# EasyEDA Pro project 刀仓照明灯.eprj

# Schematic 原理图
Board Name: ESP32s3; Create Date: 2025-05-14; Page Name: 电源; Project Name: 刀仓照明灯; Schematic Name: 原理图; Update Date: 2026-03-27; Company: 嘉立创EDA; Page Size: A3; Version: V1.0
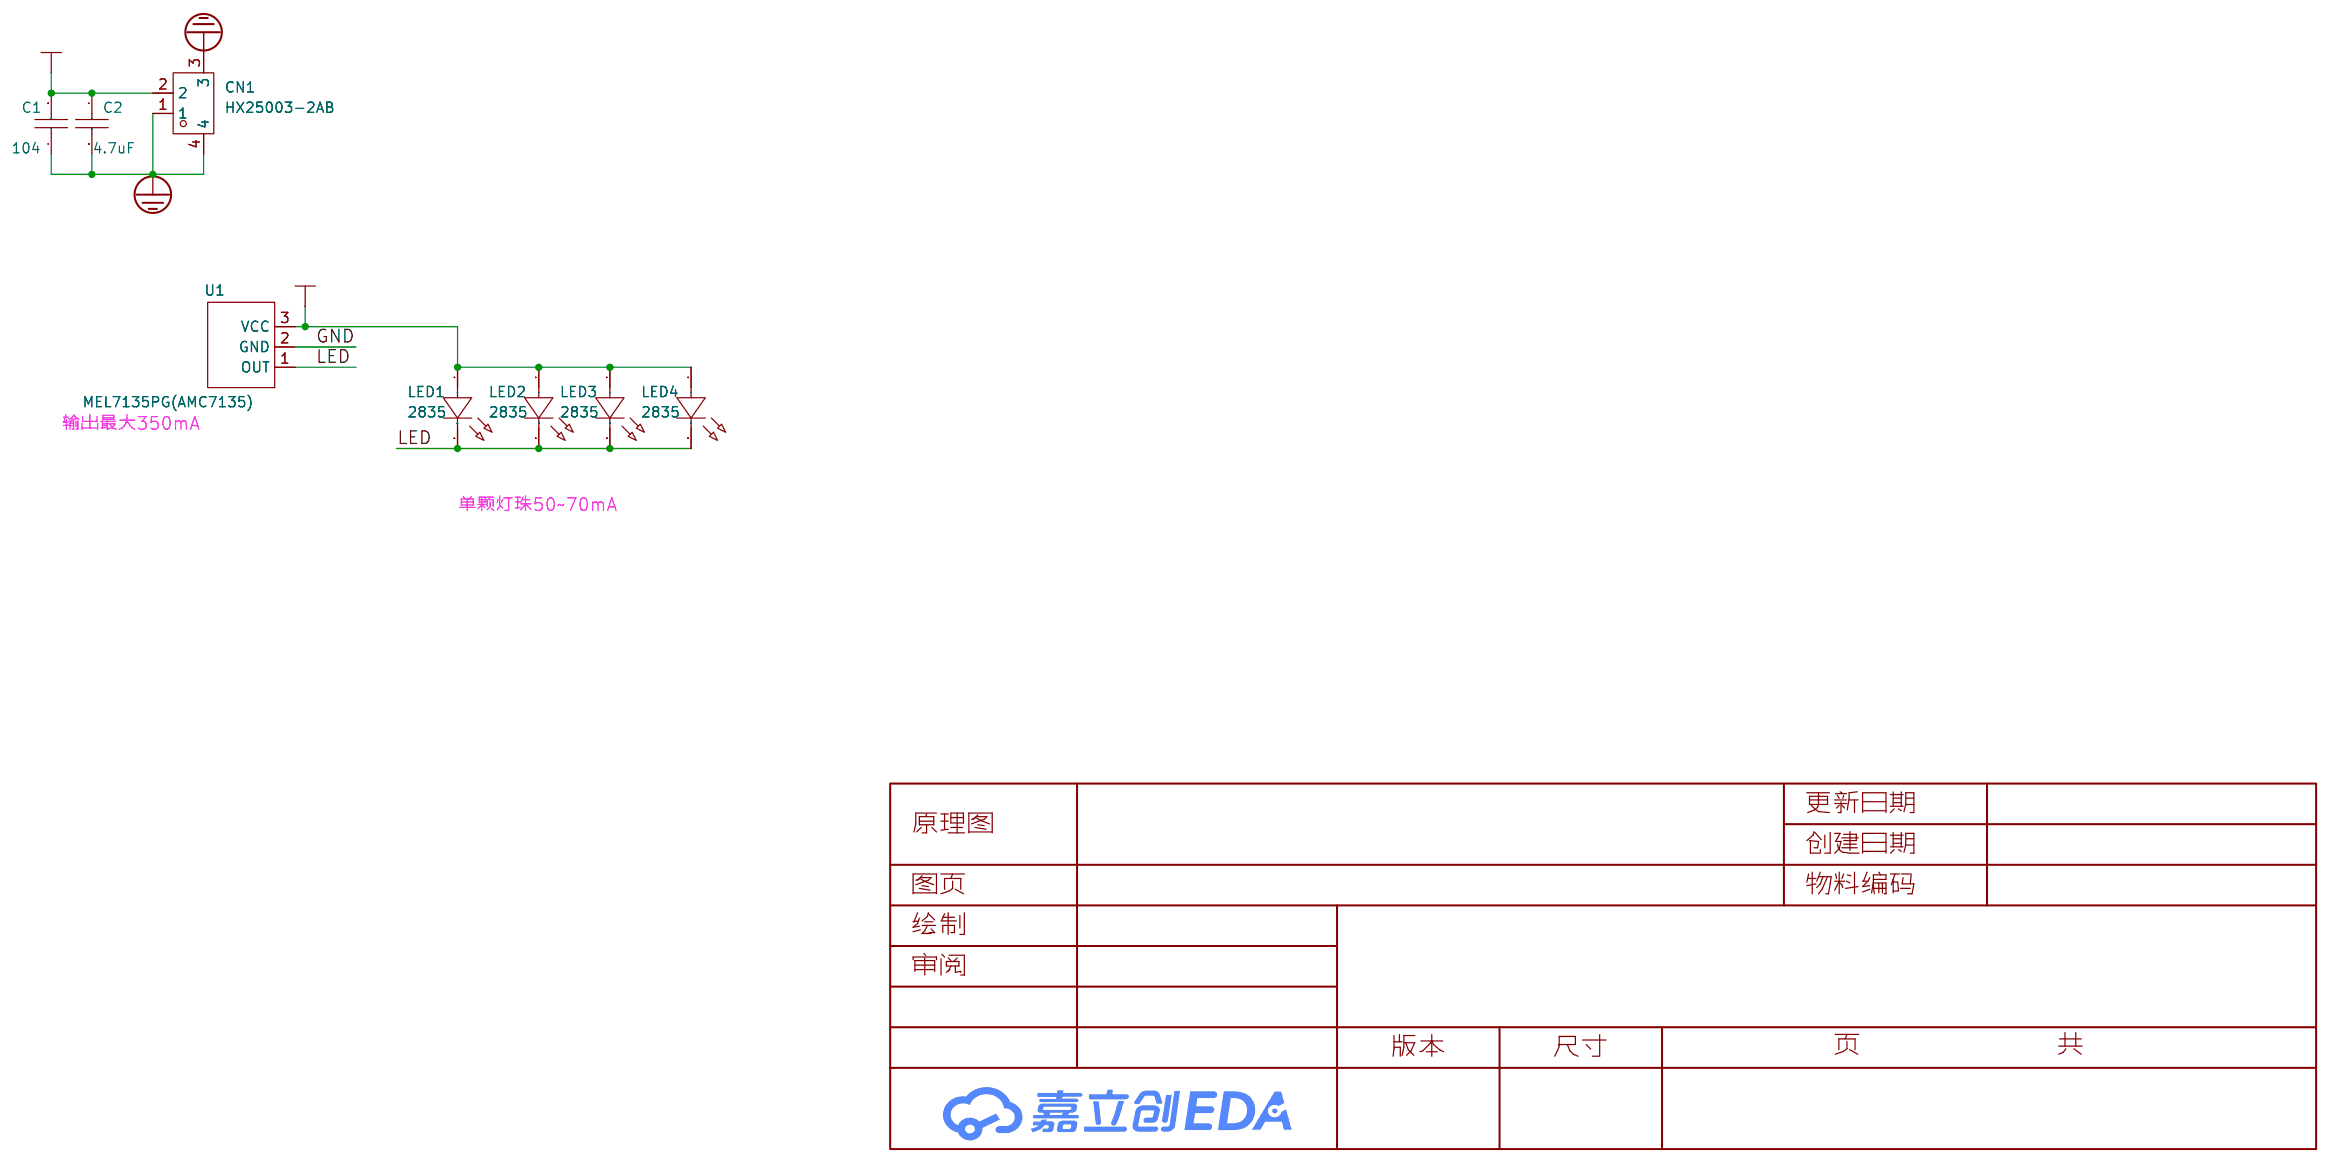
[diagram p0: schematic sheet]

## Parts
C1  104  [0603C]
C2  4.7uF  [0805C]
CN1  HX25003-2AB  [CONN-SMD_P2.50_HX25003-2AB]
LED1  2835  [LED-SMD_L3.5-W2.8_2835]
LED2  2835  [LED-SMD_L3.5-W2.8_2835]
LED3  2835  [LED-SMD_L3.5-W2.8_2835]
LED4  2835  [LED-SMD_L3.5-W2.8_2835]
U1  MEL7135PG(AMC7135)  [SOT-89-3_L4.5-W2.5-P1.50-LS4.2-BR]

## Library data of the parts
C1 = 104: Capacitor (Semiconductor SIM Model); Published: 8-Jun-2000; LatestRevisionDate: 17-Jul-2002; LatestRevisionNote: Re-released for DXP Platform.; PackageReference: C1206; Publisher: Altium Limited; Origin Footprint 2: C1206; Origin Footprint 3: 0402; Origin Footprint 4: 1310[0504]; Origin Footprint 5: 1608[0603]; Origin Footprint 6: C1210; Origin Footprint 7: C0805; Origin Footprint 8: C1206; Origin Footprint 9: 0805; Origin Footprint 10: 0805L; Design Item ID: Cap Semi; Library Name: Miscellaneous Devices
C2 = 105: Design Item ID: CAP; Library Name: SCH--װ--
CN1 = HX25003-2AB: LCSC Part Name: 1x2P 间距:2.5mm 立贴 系列:XH; Supplier Part: C442354; Manufacturer: HX(红星); Supplier Footprint: SMD,P=2.5mm; JLCPCB Part Class: 扩展库; Datasheet: https://item.szlcsc.com/datasheet/HX25003-2AB/442586.html; Supplier: LCSC; Pins Structure: 1x2P; Pitch: 2.5mm; Mounting Type: 立贴; Reference Series: XH; Number of Pins: 2P; Number of Rows: 1; Number of PINs Per Row: 2; Current Rating: 3A; Contact Material: 黄铜; Contact Plating: 锡; Operating Temperature: -25℃~+85℃; Voltage Rating: 250V; Plastic Material: PA66; Flame Retardant Rating: UL94V-0; Color: 白色
LED1-LED4 = 2835: Supplier Part: C9900165166; Supplier Footprint: SMD; Supplier: LCSC
U1 = MEL7135PG: LCSC Part Name: 电流调节器; Supplier Part: C80214; Manufacturer: MICRONE(南京微盟); Supplier Footprint: SOT-89; JLCPCB Part Class: 扩展库; Datasheet: https://item.szlcsc.com/datasheet/MEL7135PG/81359.html; Supplier: LCSC; Voltage - Input(DC): 2.7V~6V; Number of Channels: 1; Output Current: 350mA; Operating temperature: -40℃~+85℃

## Nets
5V_VCC: C1.2 C2.1 CN1.2 LED1.1(A) LED2.1(A) LED3.1(A) LED4.1(A) U1.3(VCC)
GND: C1.1 C2.2 CN1.1 CN1.3 CN1.4 U1.2(GND)
LED: LED1.2(C) LED2.2(C) LED3.2(C) LED4.2(C) U1.1(OUT)

## Notes on the sheet
- 输出最大350mA
- 单颗灯珠50~70mA

# Board PCB
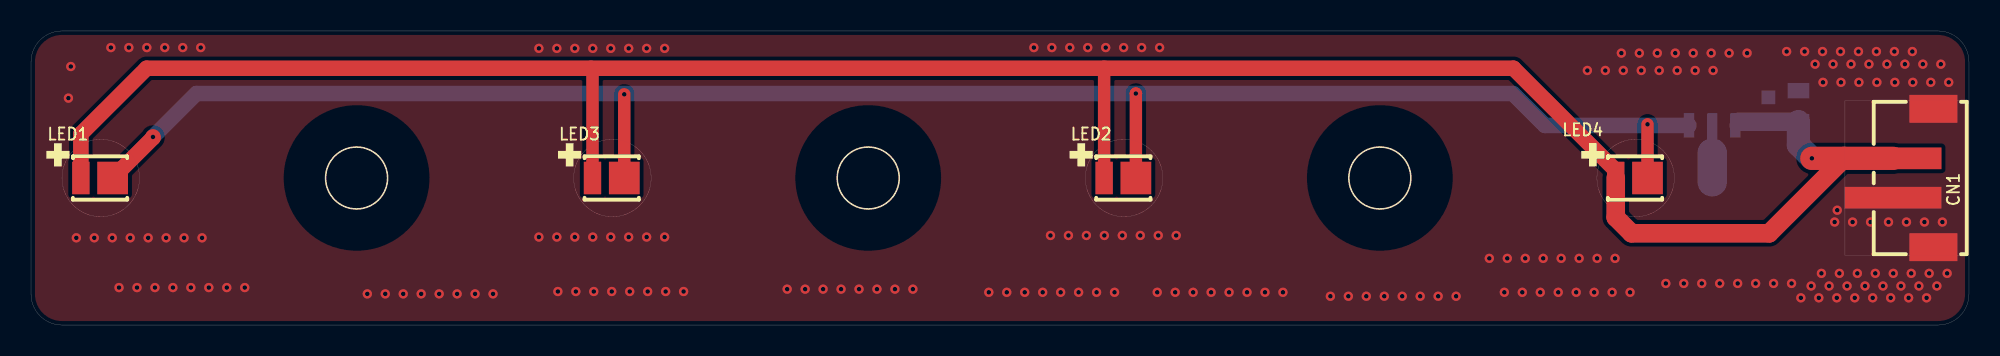
[diagram p1: board, top side]
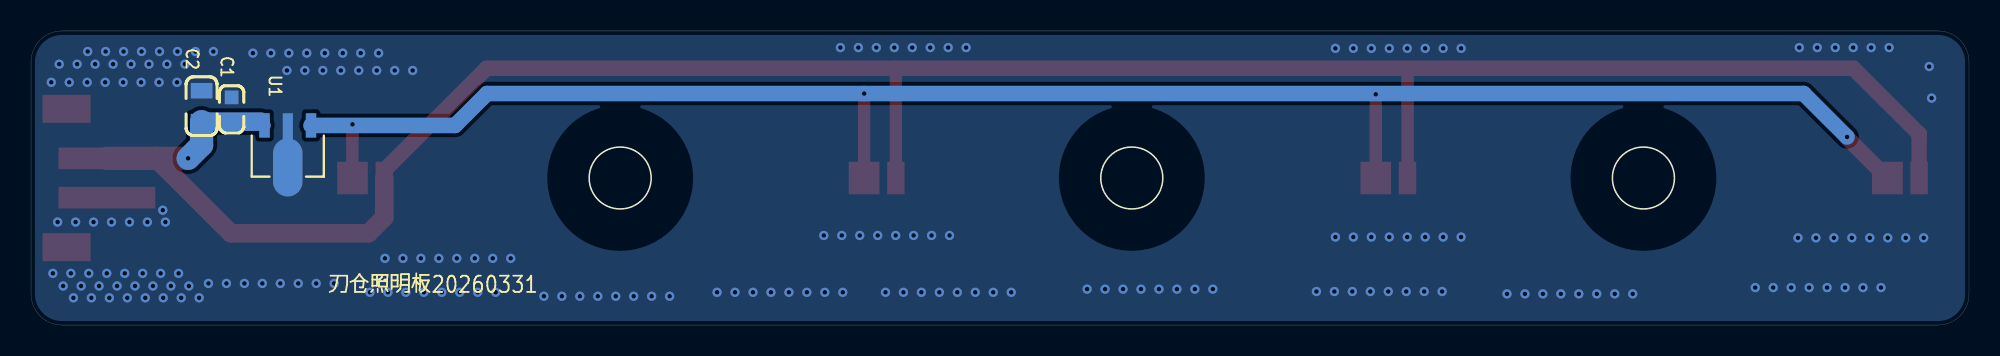
[diagram p2: board, bottom side, seen from below]

Outline 125 x 19 mm; copper layers: Top Layer, Bottom Layer. Coordinates in mm from the lower left corner of the outline.
Outline path: circle c21,9.5 r2 ; circle c54,9.5 r2 ; circle c87,9.5 r2 ; 0,17 arc(0.59,18.41) 2,19 123,19 arc(124.41,18.41) 125,17 125,2 arc(124.41,0.59) 123,0 2,0 arc(0.59,0.59) 0,2 0,17
Stack: Top Layer 0.035mm / Dielectric1 1.51mm FR4 er 4.5 / Bottom Layer 0.035mm

## Design rules (mm)
template: 用户自定义配置
spacing Default (default): track to track 0.152, other pairs 0 to 0.152
track width Default (default): min 0.254, default 0.254, max 25.4
differential pair differentialPair (default): width min 0.127, default 0.254, max 2.54; gap min 0.152, default 0.152
via Default (default): diameter min 0.25, default 0.61, max 100.025; hole min 0.2, default 0.305, max 59.995

## Placement (name value [footprint] x y rotation side)
C1  104  [0603C]  112.06 13.94 270 bottom
C2  4.7uF  [0805C]  114 14.14 90 bottom
CN1  HX25003-2AB  [CONN-SMD_P2.50_HX25003-2AB]  121.03 9.5 90 top
LED1  2835  [LED-SMD_L3.5-W2.8_2835]  4.24 9.5 0 top
LED2  2835  [LED-SMD_L3.5-W2.8_2835]  70.24 9.5 0 top
LED3  2835  [LED-SMD_L3.5-W2.8_2835]  37.24 9.5 0 top
LED4  2835  [LED-SMD_L3.5-W2.8_2835]  103.24 9.5 0 top
U1  MEL7135PG(AMC7135)  [SOT-89-3_L4.5-W2.5-P1.50-LS4.2-BR]  108.44 11.54 90 bottom

## Footprints (pads in the part's own frame, mm; a bottom-side part is the same pattern mirrored in y, then rotated)
0603C
  rect 0.889x0.889 smd: 1(-0.774,0) 2(0.774,0)
0805C
  rect 1x1.4 smd: 1(-1,0) 2(1,0)
CONN-SMD_P2.50_HX25003-2AB
  rect 1.4x6.24 smd: 1(-1.27,0.925) 2(1.27,0.925)
  rect 1.8x3.1 smd: 3(4.47,-1.675) 4(-4.47,-1.675)
LED-SMD_L3.5-W2.8_2835
  rect 1.12x2.1 smd: 1(-1.025,0)
  rect 1.98x2.1 smd: 2(1.025,0)
SOT-89-3_L4.5-W2.5-P1.50-LS4.2-BR
  rect 1.575x0.672 smd: 1(1.356,-1.5) 3(1.356,1.5)
  custom 5.377x1.9 smd: 2(-1.356,0)

## Nets
As in the schematic.

## Via types
v1: diameter 0.6, hole 0.3, Top Layer to Bottom Layer, 205 vias

## Routing (per net, layer and track width the routed paths; a pad name or vN(x,y) marks a point on that pad's centre or on a via; arc(x,y) is an arc through that point)
5V_VCC: length 152.9
  Top Layer w0.8: 36.13,16.59 36.21,16.5 LED3.1 ; 69.23,16.59 69.21,16.58 LED2.1
  Top Layer w1: LED4.1 102.21,9.99 95.62,16.59 7.46,16.59 3.21,12.35 LED1.1
  Top Layer w1.2: LED4.1 102.21,6.95 103.24,5.93 112.11,5.93 116.95,10.77
  Top Layer w1.5: v1(114.87,10.77) CN1.2
  Bottom Layer w0.8: 110.18,13.14 U1.3
  Bottom Layer w1.2: C2.1 110.18,13.14
  Bottom Layer w1.5: v1(114.87,10.77) 114,11.64 C2.1
GND:
  vias: v1(2.41,14.66) v1(2.57,16.7) v1(2.92,5.63) v1(4.08,5.63) v1(5.15,17.93) v1(5.24,5.63) v1(5.68,2.42) v1(6.31,17.93) v1(6.4,5.63) v1(6.84,2.42) v1(7.47,17.93) v1(7.56,5.63) v1(7.99,2.42) v1(8.63,17.93) v1(8.71,5.63) v1(9.15,2.42) v1(9.79,17.93) v1(9.87,5.63) v1(10.31,2.42) v1(10.94,17.93) v1(11.03,5.63) v1(11.47,2.42) v1(12.63,2.42) v1(13.79,2.42) v1(21.69,2.01) v1(22.85,2.01) v1(24.01,2.01) v1(25.17,2.01) v1(26.33,2.01) v1(27.48,2.01) v1(28.64,2.01) v1(29.8,2.01) v1(32.76,17.88) v1(32.76,5.69) v1(33.92,17.88) v1(33.92,5.69) v1(33.98,2.17) v1(35.08,17.88) v1(35.08,5.69) v1(35.14,2.17) v1(36.23,17.88) v1(36.23,5.69) v1(36.3,2.17) v1(37.39,17.88) v1(37.39,5.69) v1(37.46,2.17) v1(38.55,17.88) v1(38.55,5.69) v1(38.62,2.17) v1(39.71,17.88) v1(39.71,5.69) v1(39.77,2.17) v1(40.87,17.88) v1(40.87,5.69) v1(40.93,2.17) v1(42.09,2.17) v1(48.77,2.32) v1(49.93,2.32) v1(51.09,2.32) v1(52.25,2.32) v1(53.41,2.32) v1(54.56,2.32) v1(55.72,2.32) v1(56.88,2.32) v1(61.78,2.12) v1(62.94,2.12) v1(64.09,2.12) v1(64.68,17.93) v1(65.25,2.12) v1(65.76,5.79) v1(65.84,17.93) v1(66.41,2.12) v1(66.91,5.79) v1(67,17.93) v1(67.57,2.12) v1(68.07,5.79) v1(68.16,17.93) v1(68.73,2.12) v1(69.23,5.79) v1(69.32,17.93) v1(69.89,2.12) v1(70.39,5.79) v1(70.48,17.93) v1(71.55,5.79) v1(71.64,17.93) v1(72.71,5.79) v1(72.64,2.12) v1(72.79,17.93) v1(73.8,2.12) v1(73.86,5.79) v1(74.96,2.12) v1(76.12,2.12) v1(77.27,2.12) v1(78.43,2.12) v1(79.59,2.12) v1(80.75,2.12) v1(83.81,1.86) v1(84.97,1.86) v1(86.13,1.86) v1(87.29,1.86) v1(88.44,1.86) v1(89.6,1.86) v1(90.76,1.86) v1(91.92,1.86) v1(94.06,4.31) v1(95.03,2.12) v1(95.22,4.31) v1(96.19,2.12) v1(96.38,4.31) v1(97.35,2.12) v1(97.54,4.31) v1(98.51,2.12) v1(98.7,4.31) v1(99.66,2.12) v1(99.85,4.31) v1(100.39,16.45) v1(100.82,2.12) v1(101.01,4.31) v1(101.54,16.45) v1(101.98,2.12) v1(102.17,4.31) v1(102.58,17.57) v1(102.7,16.45) v1(103.14,2.12) v1(103.74,17.57) v1(103.86,16.45) v1(104.89,17.57) v1(105.02,16.45) v1(105.45,2.69) v1(106.05,17.57) v1(106.18,16.45) v1(106.6,2.69) v1(107.21,17.57) v1(107.34,16.45) v1(107.76,2.69) v1(108.37,17.57) v1(108.49,16.45) v1(108.92,2.69) v1(109.53,17.57) v1(110.08,2.69) v1(110.69,17.57) v1(111.24,2.69) v1(112.4,2.69) v1(113.24,17.67) v1(113.55,2.69) v1(114.16,1.76) v1(114.4,17.67) v1(114.82,2.52) v1(115.07,16.86) v1(115.31,1.76) v1(115.48,3.34) v1(115.55,17.67) v1(115.58,15.68) v1(115.98,2.52) v1(116.23,16.86) v1(116.33,6.65) v1(116.5,7.42) v1(116.47,1.76) v1(116.71,17.67) v1(116.64,3.34) v1(116.74,15.68) v1(117.14,2.52) v1(117.39,16.86) v1(117.49,6.65) v1(117.63,1.76) v1(117.8,3.34) v1(117.87,17.67) v1(117.9,15.68) v1(118.29,2.52) v1(118.55,16.86) v1(118.65,6.65) v1(118.79,1.76) v1(119.03,17.67) v1(118.96,3.34) v1(119.06,15.68) v1(119.45,2.52) v1(119.71,16.86) v1(119.81,6.65) v1(119.95,1.76) v1(120.11,3.34) v1(120.19,17.67) v1(120.22,15.68) v1(120.61,2.52) v1(120.87,16.86) v1(120.97,6.65) v1(121.11,1.76) v1(121.27,3.34) v1(121.35,17.67) v1(121.38,15.68) v1(121.77,2.52) v1(122.02,16.86) v1(122.13,6.65) v1(122.26,1.76) v1(122.43,3.34) v1(122.53,15.68) v1(122.93,2.52) v1(123.18,16.86) v1(123.28,6.65) v1(123.59,3.34) v1(123.69,15.68)
LED: length 119.2
  Top Layer w0.8: LED4.2 v1(104.27,12.97) ; LED3.2 v1(38.27,14.91) ; LED2.2 71.27,14.95 v1(71.26,14.96)
  Top Layer w1: LED1.2 7.87,12.1 v1(7.87,12.15)
  Bottom Layer w1: U1.1 97.65,12.9 95.59,14.96 v1(71.26,14.96) 10.67,14.96 v1(7.87,12.15)

## Copper pours and planes (outline as drawn; the poured copper is in the pictures)
GND on Top Layer: -1.42,21.03 125.93,21.03 125.93,-1.01 -1.42,-1.01
GND on Bottom Layer: -1.37,21.08 125.98,21.08 125.98,-0.96 -1.37,-0.96

## Text on the board
Bottom Silkscreen Layer: 刀仓照明板20260331
